# Altium project IO BOARD CERES-V4.PrjPcb
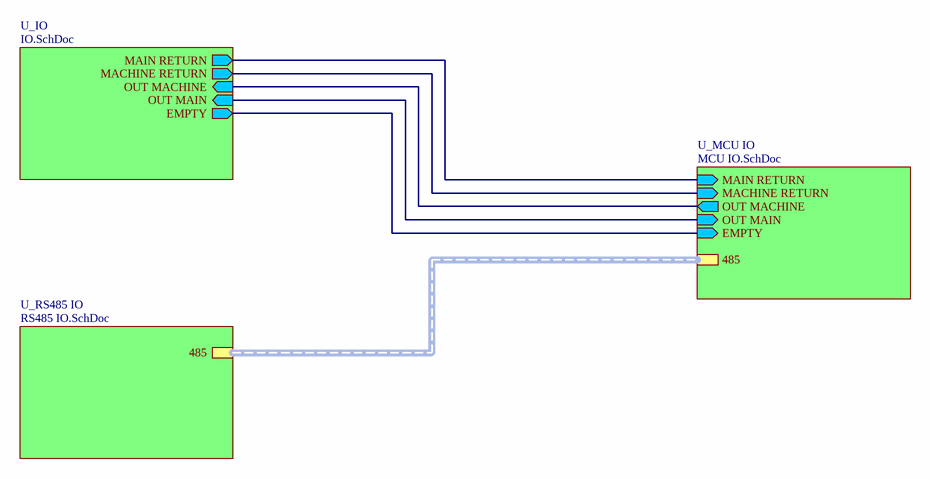
[diagram p0: TOPSHEET.SchDoc]
4 sheets, 62 parts. Net scope: hierarchical (ports join the sheet entries above them; power ports are global).
Board file: IO BOARD CERES V4.PcbDoc
Sheets:
  TOPSHEET.SchDoc
    U_IO = IO.SchDoc
    U_MCU IO = MCU IO.SchDoc
    U_RS485 IO = RS485 IO.SchDoc

## Sheet TOPSHEET.SchDoc: TOPSHEET
size A4; Date: 31 08 2013; Author: Rachid AKKOUCHE; CompanyName: MDI; DrawnBy: Rachid AKKOUCHE; Engineer: Rachid AKKOUCHE; Organization: RASoftware; Address1: 52 J03 rue de la crèche; Address2: 77100 MEAUX; Address3: FRANCE; DocumentNumber: BRA2013090103C1; Revision: C; SheetNumber: 1; SheetTotal: 4; Telephone: +33651604047; Email: rachid.akkouche@wanadoo.fr; Dessinepar: -; Verifiepar: -; Time: 13:22

### Sub-sheets
U_IO = IO.SchDoc: MAIN RETURN (out), OUT MACHINE (in), MACHINE RETURN (out), OUT MAIN (in), EMPTY (out)
U_MCU IO = MCU IO.SchDoc: MAIN RETURN (in), 485 (harness EIA-485), OUT MACHINE (out), MACHINE RETURN (in), EMPTY (in), OUT MAIN (in)
U_RS485 IO = RS485 IO.SchDoc: 485 (harness EIA-485)

### Nets
PGEC1: sheet U_IO/EMPTY, sheet U_MCU IO/EMPTY
PGED1: sheet U_IO/OUT MAIN, sheet U_MCU IO/OUT MAIN
NetC2_1: sheet U_IO/MAIN RETURN, sheet U_MCU IO/MAIN RETURN
NetC3_1: sheet U_IO/MACHINE RETURN, sheet U_MCU IO/MACHINE RETURN
NetQ2_1: sheet U_IO/OUT MACHINE, sheet U_MCU IO/OUT MACHINE

### Buses and harness runs
harness sheet U_MCU IO/485 = sheet U_RS485 IO/485

### Notes on the sheet
- Ce document est la propriété de
- Project:
- Il ne peut être divulgué sans l'accord écrit de l'un de ses représentants dûment mandaté
- Title:
- Number:
- Date:
- Time:
- Size:
- A4
- Revision:
- Sheet
- of
- 52 J03 rue de la crèche
- Draw by:
- 77100 Meaux

## Sheet IO.SchDoc: IO
size A4; Date: 31 08 2013; Author: Rachid AKKOUCHE; CompanyName: MDI; DrawnBy: Rachid AKKOUCHE; Engineer: Rachid AKKOUCHE; Organization: RASoftware; Address1: 52 J03, rue de la crèche; Address2: 77100 MEAUX; Address3: FRANCE; DocumentNumber: BRA2013090103C3; Revision: C; SheetNumber: 3; SheetTotal: 4; Telephone: +33651604047; Email: rachid.akkouche@wanadoo.fr; Dessinepar: -; Verifiepar: -; Property: RASoftware; PageSetup: Record=PageOptions|CenterHorizontal=True|CenterVertical=True|PrintScale=0.88|XCorrection=1.00|YCorrection=1.00|PrintKind=0|BorderSize=5000000|LeftOffset=0|BottomOffset=0|Orientation=2|PaperLength=1000|PaperWidth=1000|Scale=100|PaperSource=7|PrintQuality=-3|MediaType=1|DitherType=10|PrintScaleMode=1|PaperKind=16K|PaperIndex=409; Time: 13:22
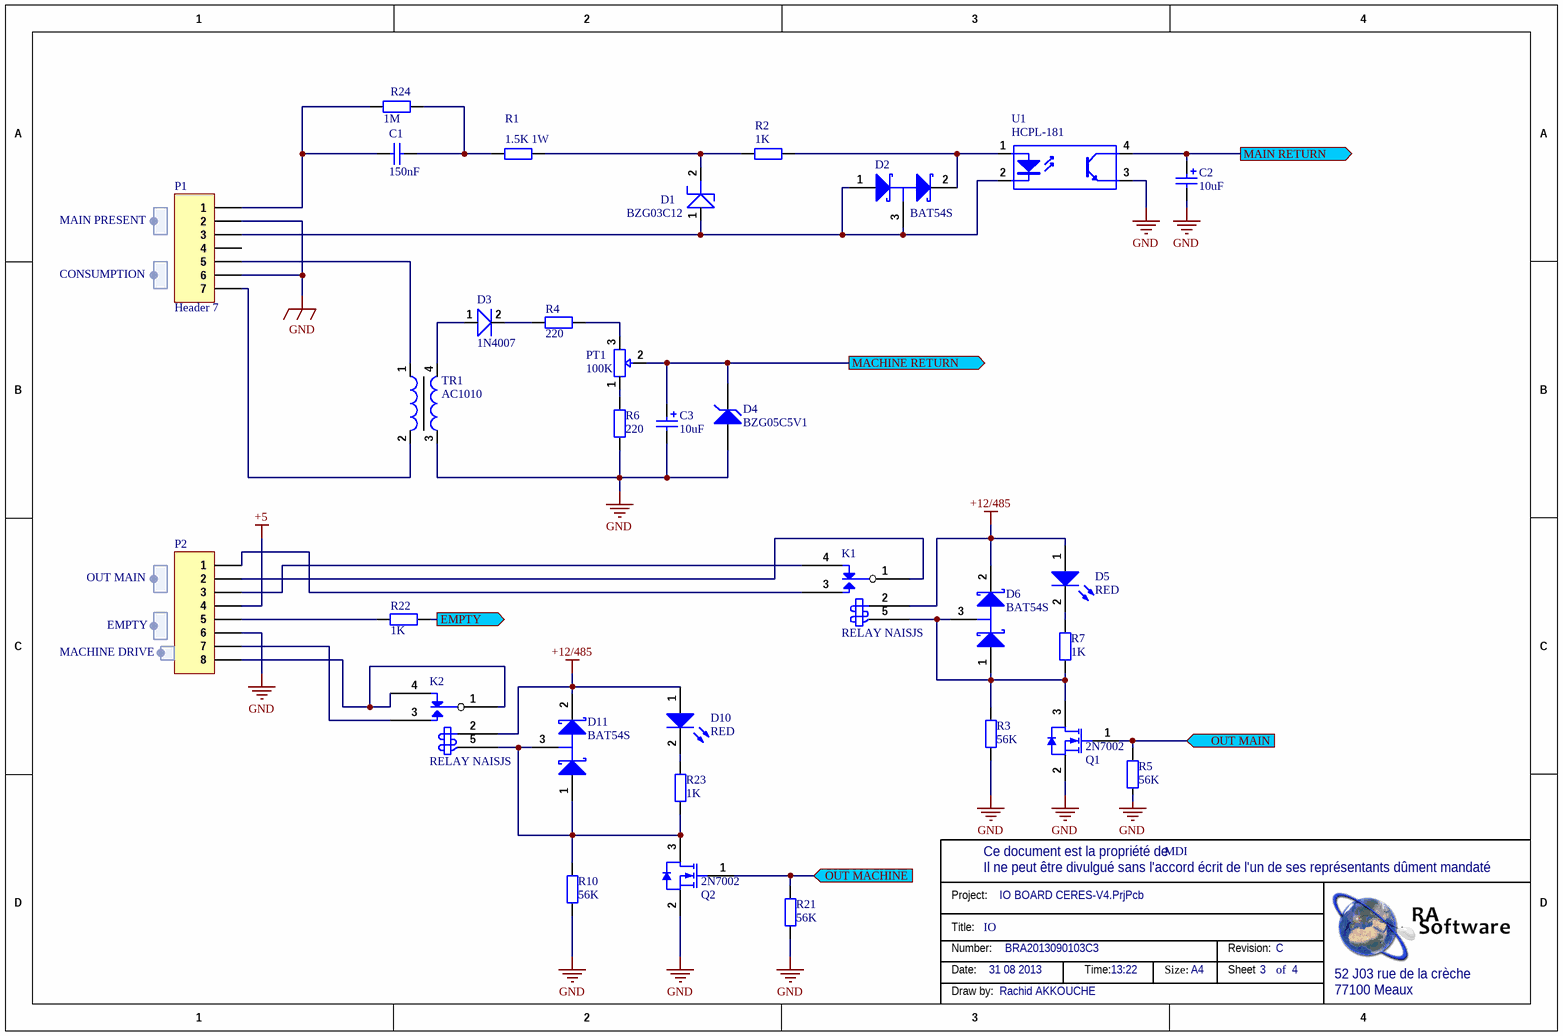
[diagram p1: IO.SchDoc]

### Parts
C1  150nF  [C1210]
C2  10uF  [C0805]
C3  10uF  [C0805]
D1  BZG03C12  [sma]
D2  BAT54S  [SOT23]
D3  1N4007  [SMA]
D4  BZG05C5V1  [SMA]
D5  Couleur: RED  [0603-LEDR]  (hidden comment: HSMH-C190)
D6  BAT54S  [SOT23]
D10  Couleur: RED  [0603-LEDR]  (hidden comment: HSMH-C190)
D11  BAT54S  [SOT23]
K1  RELAY NAISJS  [RELAIG5L]
K2  RELAY NAISJS  [RELAIG5L]
P1  Header 7  [CO7P508-90]
P2  Header 8  [CO8P508 - 90°]  (value not drawn)
PT1  100K  [3361P]
Q1  2N7002  [SOT23]
Q2  2N7002  [SOT23]
R1  1.5K 1W  [R0805]
R2  1K  [R0805]
R3  56K  [R0805]
R4  220  [R0805]
R5  56K  [R0805]
R6  220  [R0805]
R7  1K  [R0805]
R10  56K  [R0805]
R21  56K  [R0805]
R22  1K  [R0805]
R23  1K  [R0805]
R24  1M  [R0805]
TR1  AC1010  [TR-AC10XX]  (no BOM)
U1  HCPL-181  [OPTO-4PIN]

### Ports
EMPTY (out), MACHINE RETURN (out), MAIN RETURN (out), OUT MACHINE (in), OUT MAIN (in)

### Harnesses
?: 

### Nets
+5: P2.4
+12/485: D5.1(A) D6.2(K) D10.1(A) D11.2(K) K1.2(COIL1) K2.2(COIL1)
GND: C2.2 C3.2 D4.1(A) P1.2 P1.6 P2.6 Q1.2(S) Q2.2(S) R3.1 R5.1 R6.1 R10.1 R21.1 TR1.3 U1.3(E)
PGEC1: R22.1 ; port EMPTY
PGED1: Q1.1(G) R5.2 ; port OUT MAIN
NetC1_1: C1.1 P1.1 R24.2
NetC1_2: C1.2 R1.2 R24.1
NetC2_1: C2.1 U1.4(C) ; port MAIN RETURN
NetC3_1: C3.1 D4.2(K) PT1.2 ; port MACHINE RETURN
NetD1_1: D1.1 D2.1(A) D2.3(C) P1.3 U1.2(K)
NetD1_2: D1.2 R1.1 R2.1
NetD2_2: D2.2(K) R2.2 U1.1(A)
NetD3_1: D3.1 TR1.4
NetD3_2: D3.2 R4.2
NetD5_2: D5.2(K) R7.2
NetD6_1: D6.1(A) D6.3(C) K1.5(COIL2) Q1.3(D) R3.2 R7.1
NetD10_2: D10.2(K) R23.2
NetD11_1: D11.1(A) D11.3(C) K2.5(COIL2) Q2.3(D) R10.2 R23.1
NetK1_1: K1.1(COMMON) P2.2
NetK1_3: K1.3(NO) P2.1
NetK1_4: K1.4(NC) P2.3
NetK2_1: K2.1(COMMON) K2.4(NC) P2.8
NetK2_3: K2.3(NO) P2.7
NetP1_5: P1.5 TR1.1
NetP1_7: P1.7 TR1.2
NetP2_5: P2.5 R22.2
NetPT1_1: PT1.1 R6.2
NetPT1_3: PT1.3 R4.1
NetQ2_1: Q2.1(G) R21.2 ; port OUT MACHINE

Not connected (* = marked no-connect by the designer): P1 4

### Notes on the sheet
- MAIN PRESENT
- CONSUMPTION
- OUT MAIN
- MACHINE DRIVE
- EMPTY
- Ce document est la propriété de
- Project:
- Il ne peut être divulgué sans l'accord écrit de l'un de ses représentants dûment mandaté
- Title:
- Number:
- Date:
- Time:
- Size:
- A4
- Revision:
- Sheet
- of
- 52 J03 rue de la crèche
- Draw by:
- 77100 Meaux

### Library data of the parts
C1 = Cap: Capacitor; Manufacturer: KEMET; Manufacturer Part Number: C1210V154KCRACTU; Gamme de produit: KEMET - ArcShield V Series; Capacité: 0.15; Tolérance de capacité: ± 10%; Diélectrique: X7; Tension: 500; Boîtier de condensateur Céramique: 1210 [3225 Metric]; Température d'utilisation min: -55; Température de fonctionnement max..: 125; Type de packaging: Bande découpée; SVHC: No SVHC (16-Dec-2013); Bornes de condensateur: CMS; Température de fonctionnement: -55°C à +125; Type de boîtier de condensateur: 1210 [3225 Metric]<!--FANDB--><div class="features-and-benefits-container"></div>; Supplier 1: Farnell; Supplier Part Number 1: 2085200; RoHS: YES; Pricing 1: 10=0,34, 50=0,28, 100=0,154, 500=0,125, 2500=0,097 (EUR); MSL: MSL 1 - Illimité; Tolérance de capacité ±: ± 10%; ComponentLink1URL: http://www.farnell.com/datasheets/1698777.pdf; ComponentLink1Description: http://www.farnell.com/datasheets/1698777.pdf
C2 C3 = Cap Pol 100uF: Polarized Capacitor; Manufacturer: EPCOS; Manufacturer Part Number: B41142A4107M; Product Range: EPCOS - B41142 Series; Capacité: 100; Tolérance de capacité: ± 20%; Tension: 16; Type de boîtier de condensateur: Radial Can - SMD; Diamètre: 6.3; Résistance, ESR: 0.16; Hauteur: 7.7; Courant d'ondulation c.a.: 300; Type de packaging: Cut Tape; Durée de vie @ température: 2000 heures @ 105; Température d'utilisation min: -55; Température de fonctionnement max..: 105; SVHC: No SVHC (19-Dec-2012); Impédance: 0.26; Température de fonctionnement: -55°C à +105; Température, ESR: 20; Type de boîtier: CMS; Supplier 1: Farnell; RoHS: YES; Pricing 1: 10=0,123, 50=0,095, 100=0,078, 250=0,07, 1000=0,062 (EUR); Courant d'ondulation c.a. à  100Hz: 300; Fréquence, impédance: 100; Longueur/hauteur: 7.7; Température, courant ondulatoire: 105; Température, impédance: 20; ComponentLink1URL: http://www.epcos.com/inf/20/30/db/alu_x/B41142.pdf; ComponentLink1Description: http://www.epcos.com/inf/20/30/db/alu_x/B41142.pdf; Supplier Part Number 1: 1735328
D1 = DZ: Manufacturer: VISHAY; Manufacturer Part Number: BZG03C12TR3; Supplier 1: Farnell; Supplier Part Number 1: 9398090; RoHS: YES; Pricing 1: 5=0,62, 100=0,37, 1500=0,26, 3000=0,138, 7000=0,135, 30000=0,132, 30000=0,129 (EUR); ComponentLink1URL: http://www.farnell.com/datasheets/69906.pdf; ComponentLink1Description: http://www.farnell.com/datasheets/69906.pdf
D2 D6 D11 = BAT54S: Schottky Barrier Double Diode; Manufacturer: MULTICOMP; Courant, If moy.: 200; Tension, Vrrm: 30; Tension, Vf max..: 400; Temps trr max.: 5; Courant, Ifs max.: 600; Type de boîtier diode: SOT-23; Nombre de broches: 3; SVHC: No SVHC (19-Dec-2012); Configuration diode: Dual Series; Température, Tj max..: 150; Type de terminaison: SMD; Température d'utilisation min: -55; Courant, If, Vf: 10; Courant, Ir, max..: 2; Marquage, CMS: L44; Température de fonctionnement: -55°C à +150; Supplier 1: Farnell; Supplier Part Number 1: 1621835; Manufacturer Part Number: BAT54S; RoHS: YES; Stock 1: 52055; Pricing 1: 10=0,102, 250=0,074, 1000=0,06, 3000=0,053 (EUR); Diode Type: Schottky; Type de boîtier: SOT-23; courant Ifsm: 600; ComponentLink1URL: http://www.farnell.com/datasheets/1317753.pdf; ComponentLink1Description: http://www.farnell.com/datasheets/1317753.pdf; Température de fonctionnement max..: 150
D3 = D: Manufacturer: FAIRCHILD SEMICONDUCTOR; Manufacturer Part Number: S1M; Supplier 1: Farnell; Supplier Part Number 1: 9843841; RoHS: YES; Stock 1: 333361; Pricing 1: 10=0,14, 100=0,0666, 200=0,061, 500=0,0574, 1000=0,0293 (EUR); ComponentLink1URL: http://www.farnell.com/datasheets/1766308.pdf; ComponentLink1Description: http://www.farnell.com/datasheets/1766308.pdf
D4 = BZG05C5V1: Silicon Zener Diode (3W); Manufacturer: VISHAY; Manufacturer Part Number: BZG05C5V1TR3; Supplier 1: Farnell; Supplier Part Number 1: 9398015; RoHS: YES; Stock 1: 8912; Pricing 1: 5=0,294, 100=0,122, 1500=0,113, 3000=0,111, 9000=0,107, 30000=0,105, 30000=0,103, 90000=0,101 (EUR); ComponentLink1URL: http://www.farnell.com/datasheets/69919.pdf; ComponentLink1Description: http://www.farnell.com/datasheets/69919.pdf
D5 D10 = HSMH-C190: Surface Mount Chip LED, Red; Manufacturer: AVAGO TECHNOLOGIES; Manufacturer Part Number: HSMH-C190.; Taille de lampe: 0.8mm x 1; Couleur de LED: Rouge; Intensité lumineuse: 17; Angle, vision: 170°; Courant, direct, If: 20; Tension, direct à  If: 1.8; Montage LED: CMS; Forme de lentille: Rectangulaire; Longueur d'onde typ.: 626; SVHC: No SVHC (19-Dec-2012); Dissipation de puissance: 65; Intensité lumineuse min. à  If: 2.8; Intensité lumineuse typique: 10; Largeur (externe): 0.8; Longueur d'onde dominante: 639; Longueur d'onde, crête: 630; Longueur/hauteur: 1.6; Matière: AlGaAs; Nombre de broches: 2; Orientation de montage opto: Dessus; Orientation sortie de lumière: Top Emitting; Température de fonctionnement: -30°C à +85; Température de fonctionnement max..: 85; Température, stockage min.: -40; Température d'utilisation min: -30; Tension, Vf max..: 2.6; Tension, Vf min.: 2.1; Type de LED: Standard; Supplier 1: Farnell; Supplier Part Number 1: 8554641; RoHS: YES; Pricing 1: 5=0,06, 25=0,059, 100=0,057, 250=0,052, 500=0,047 (EUR); MSL: MSL 2A - 4 semaines; Couleur, LED: Rouge; Profondeur: 0.8; Température, stockage max..: 85; Tension, Vf typ.: 1.8; ComponentLink1URL: http://www.farnell.com/datasheets/313031.pdf; ComponentLink1Description: http://www.farnell.com/datasheets/313031.pdf; ComponentLink2URL: http://www.farnell.com/datasheets/55927.pdf; ComponentLink2Description: http://www.farnell.com/datasheets/55927.pdf
K1 K2 = RELAY NAISJS: Manufacturer: OMRON ELECTRONIC COMPONENTS; Manufacturer Part Number: G5LA1A412DC; Type de relais: Puissance; Tension, bobine c.c. nom.: 12; Courant de contact max..: 10; Tension AC nominale du contact: 250; Tension DC nominale du contact: 24; Résistance, bobine: 400; Configuration des contacts: SPST-NO; Type de bobine: CC; Courant de bobine: 30; Puissance de fonctionnement nominale: 360; Montage relais: Traversant; Largeur (externe): 15.8; Profondeur: 19.8; SVHC: No SVHC (20-Jun-2013); Supplier 1: Farnell; Supplier Part Number 1: 2213790; RoHS: YES; Pricing 1: 1=0,84, 10=0,74, 50=0,66, 100=0,59, 250=0,54 (EUR); Hauteur, dimension externe: 15.8; ComponentLink1URL: http://www.farnell.com/datasheets/1648381.pdf; ComponentLink1Description: http://www.farnell.com/datasheets/1648381.pdf
P1 = Header 7: Header, 7-Pin; Manufacturer: FCI; Manufacturer Part Number: 20020110-H071A01LF; Anschlussart: Löten; Anzahl der Kontakte: 7; Anzahl der Reihen: 1; Betriebsspannung: 300 V ac; Breite: 12mm; Farbe: Grün; Gehäuseausrichtung: Rechtwinklig; Gender: Male; Länge: 37.56mm; Montagetyp: Durchsteckmontage; Nennstrom: 12A; Raster: 5.08mm; Serie: 06-508; Tiefe: 8.5mm; Typ: Stiftsockel; Currency: ÿNILÿ; Product StockNumber: 707-5477; Connecteur femelle: 790-0714; LatestRevisionDate: 17-Jul-2002; LatestRevisionNote: Re-released for DXP Platform.; Publisher: Altium Limited; Supplier 1: RS-Components; Supplier Part Number 1: 707-5477; RoHS: Compliant; Category: Steckverbinder; Stock 1: 0; Pricing 1: 5=0,778, 375=0,682, 1250=0,584, 2500=0,486, 5000=0,39 (ÿNILÿ); Material: Nylon; Product Status: ÿNILÿ; Future Stock Date: ÿNILÿ
P2 = Header 8: Header, 8-Pin; Manufacturer: CAMDENBOSS; Manufacturer Part Number: CTB9350/8AO; Gamme de produit: CAMDENBOSS - CTB9350; Type de terminaison de contact: Traversant; Genre: Mâle; Nombre de contacts: 8; Nombre de rangées: 1; Pas: 5; Plaquage du contact: Cuivre; Matériau du contact: Laiton; SVHC: No SVHC (16-Jun-2014); Couleur: vert; Courant: 12; Inflammabilité: UL94V-0; Matériau, vis: Acier; Méthode de terminaison: A souder; Taille du filetage: M3; Température de fonctionnement max..: 125; Température d'utilisation min: -20; Tension nominale Vac: 380; Terminaison du contact: Traversant à angle droit<!--FANDB--><div class="features-and-benefits-container"></div>; Connecteur femelle: 3881891; LatestRevisionDate: 17-Jul-2002; LatestRevisionNote: Re-released for DXP Platform.; Publisher: Altium Limited; Supplier 1: Farnell; Supplier Part Number 1: 3882251; RoHS: YES; Pricing 1: 1=0,963, 25=0,847, 100=0,793, 250=0,732, 700=0,659, 3000=0,581, 3000=0,523, 20000=0,471 (EUR); ComponentLink1URL: http://www.farnell.com/datasheets/1708040.pdf; ComponentLink1Description: http://www.farnell.com/datasheets/1708040.pdf
PT1 = RV: Manufacturer: BOURNS; Manufacturer Part Number: 3361P-1-104GLF; Résistance, piste: 100; Nombre de tours: 1; Tolérance de résistance: ± 10%; Coefficient de température: ± 100; Puissance: 500; Montage du potentiomètre: CMS; SVHC: No SVHC (16-Dec-2013); Force diélectrique, Vca: 900; Largeur (externe): 6.71; Longueur/hauteur: 5.21; Profondeur: 7.04; Série: 3361; Température de fonctionnement: -55°C à +125; Température de fonctionnement max..: 125; Température d'utilisation min: -55; Tension: 300; Type d'ajustement: Fente tournevis; Type de packaging: Bande découpée; Type de résistance: Cermet<!--FANDB--><div class="features-and-benefits-container"></div>; Supplier 1: Farnell; Supplier Part Number 1: 1696064; RoHS: YES; Pricing 1: 5=1,35, 50=1,11, 100=0,99, 250=0,93, 750=0,87 (EUR); ComponentLink1URL: http://www.farnell.com/datasheets/1563530.igs; ComponentLink1Description: http://www.farnell.com/datasheets/1563530.igs; ComponentLink2URL: http://www.farnell.com/datasheets/1815105.pdf; ComponentLink2Description: http://www.farnell.com/datasheets/1815105.pdf; ComponentLink3URL: http://www.farnell.com/cad/1563578.stp; ComponentLink3Description: http://www.farnell.com/cad/1563578.stp
Q1 Q2 = 2N7002: N-channel Enhancement Mode Field-effect Transistor; Manufacturer: FAIRCHILD SEMICONDUCTOR; Supplier 1: Farnell; Supplier Part Number 1: 9845313; Manufacturer Part Number: 2N7002; RoHS: YES; Pricing 1: 5=0,138, 25=0,13, 100=0,059, 1000=0,049, 3000=0,026, 6000=0,0234 (EUR); ComponentLink1URL: http://www.farnell.com/datasheets/660093.pdf; ComponentLink1Description: http://www.farnell.com/datasheets/660093.pdf; ComponentLink2URL: http://www.farnell.com/datasheets/410597.pdf; ComponentLink2Description: http://www.farnell.com/datasheets/410597.pdf
R1 = Resistor 0805 470: Resistor; Manufacturer: MULTICOMP; Manufacturer Part Number: MC0.1W08051%470RFR; Supplier 1: Farnell; Supplier Part Number 1: 2129087; RoHS: YES; Pricing 1: 5000=0,001 (EUR); ComponentLink1URL: http://www.farnell.com/datasheets/1636796.pdf; ComponentLink1Description: http://www.farnell.com/datasheets/1636796.pdf
R2 = Res2: Resistor; Manufacturer: MULTICOMP; Manufacturer Part Number: MC0.1W08051%1KFR; Product Range: MULTICOMP - MC Series; Résistance: 1; Puissance: 100; Tolérance de résistance: ± 1%; Type de boîtier de résistance: 0805; Type de résistance: Couche épaisse; Coefficient de température: ± 100; Tension: 150; Type de packaging: Full Reel; Resistor Mounting: CMS; Supplier 1: Farnell; Supplier Part Number 1: 2129113; RoHS: YES; Stock 1: 599995; Pricing 1: 5000=0,001 (EUR); MSL: MSL 1 - Illimité; ComponentLink1URL: http://www.farnell.com/datasheets/1636796.pdf; ComponentLink1Description: http://www.farnell.com/datasheets/1636796.pdf
R3 R5 R10 R21 = Resistor 0805 56K: Resistor; Manufacturer: MULTICOMP; Manufacturer Part Number: MC0.1W08051%56KFR; Product Range: MULTICOMP - MC Series; Résistance: 56; Puissance: 100; Tolérance de résistance: ± 1%; Type de boîtier de résistance: 0805; Type de résistance: Couche épaisse; Coefficient de température: ± 100; Tension: 150; Type de packaging: Full Reel; Resistor Mounting: CMS; Resistor Terminals: (Non Disponible); Supplier 1: Farnell; RoHS: YES; Pricing 1: 5000=0,001 (EUR); MSL: (Non Applicable); ComponentLink1URL: http://www.farnell.com/datasheets/1716700.pdf; ComponentLink1Description: http://www.farnell.com/datasheets/1716700.pdf; Supplier Part Number 1: 2129258
R4 R6 = Resistor 0805 220: Resistor; Manufacturer: MULTICOMP; Manufacturer Part Number: MC01W08051220R; Gamme de produit: MULTICOMP - MC Series; Puissance: 100; Tolérance de résistance: ± 1%; Type de boîtier de résistance: 0805; Type de résistance: Couche épaisse; Coefficient de température: ± 100; Tension: 150; Type de packaging: Bande et Bobine; SVHC: No SVHC (20-Jun-2013); Montage de résistance: CMS; Quantité par bobine: 5000; Supplier 1: Farnell; RoHS: YES; Stock 1: 199995; Pricing 1: 5000=0,001, 25000=0,0009, 50000=0,0008 (EUR); Résistance: 220; MSL: -; ComponentLink1URL: http://www.farnell.com/datasheets/1729047.pdf; ComponentLink1Description: http://www.farnell.com/datasheets/1729047.pdf; Supplier Part Number 1: 2129060
R7 R22 R23 = Resistor 0805 1K: Resistor; Manufacturer: MULTICOMP; Manufacturer Part Number: MC0.1W08051%1KFR; Product Range: MULTICOMP - MC Series; Résistance: 1; Puissance: 100; Tolérance de résistance: ± 1%; Type de boîtier de résistance: 0805; Type de résistance: Couche épaisse; Coefficient de température: ± 100; Tension: 150; Type de packaging: Full Reel; Resistor Mounting: CMS; Supplier 1: Farnell; RoHS: YES; Pricing 1: 5000=0,001 (EUR); MSL: MSL 1 - Illimité; ComponentLink1URL: http://www.farnell.com/datasheets/1716700.pdf; ComponentLink1Description: http://www.farnell.com/datasheets/1716700.pdf; Supplier Part Number 1: 2129113
R24 = Resistor 0805 470: Resistor; Manufacturer: MULTICOMP; Manufacturer Part Number: MCWR08X1004FTL; Gamme de produit: MULTICOMP - MCWR Series; Résistance: 1; Puissance: 125; Tolérance de résistance: ± 1%; Type de boîtier de résistance: 0805 [2012 Metric]; Type de résistance: Couche épaisse; Coefficient de température: ± 100; Tension: 150; Type de packaging: Bande et Bobine; Supplier 1: Farnell; Supplier Part Number 1: 2446913; RoHS: YES; Stock 1: 119995; Pricing 1: 5000=0,0006 (EUR); MSL: -<!--FANDB--><div class="features-and-benefits-container"></div>; ComponentLink1URL: http://www.farnell.com/datasheets/1849611.pdf; ComponentLink1Description: http://www.farnell.com/datasheets/1849611.pdf
TR1 = AC1010: Manufacturer: ACME ELECTRIC; Manufacturer Part Number: AC-1010; Input Current: 10; Turns Ratio: 1; Frequency Min: 50; Frequency Max: 60; Secondary Burden Resistance: 41.8; Transformer Mounting: Through Hole; External Depth: 11.12; Supplier 1: Farnell; Supplier Part Number 1: 1707836; RoHS: YES; Pricing 1: 1=12,43, 10=10,33, 25=8,31, 50=7,37, 100=6,71 (EUR); DC Resistance Max: 41.8; ComponentLink1URL: http://www.amveco.com/pdf/AC1010.pdf; ComponentLink1Description: http://www.amveco.com/pdf/AC1010.pdf
U1 = Optoisolator1: 4-Pin Phototransistor Optocoupler; Manufacturer: AVAGO TECHNOLOGIES; Manufacturer Part Number: HCPL-181-00AE; Supplier 1: Farnell; Supplier Part Number 1: 1244526RL; RoHS: YES; Pricing 1: 150=0,27, 250=0,217, 500=0,191, 2000=0,143, 2000=0,14, 20000=0,137 (EUR); ComponentLink1URL: http://www.farnell.com/datasheets/317140.pdf; ComponentLink1Description: http://www.farnell.com/datasheets/317140.pdf

## Sheet MCU IO.SchDoc: MCU
size A4; Date: 30 08 2013; Author: Rachid AKKOUCHE; CompanyName: MDI; DrawnBy: Rachid AKKOUCHE; Engineer: Rachid AKKOUCHE; Organization: RASoftware; Address1: 52 J03, rue de la crèche; Address3: 77100 MEAUX; Address4: FRANCE; DocumentNumber: BRA2013090103C2; Revision: C; SheetNumber: 2; SheetTotal: 4; Telephone: +33651604047; Email: rachid.akkouche@wanadoo.fr; Dessinepar: -; Verifiepar: -; Property: RASoftware; Time: 13:00; ProjectName: IO BOARD CERES-V3; Application_BuildNumber: 01
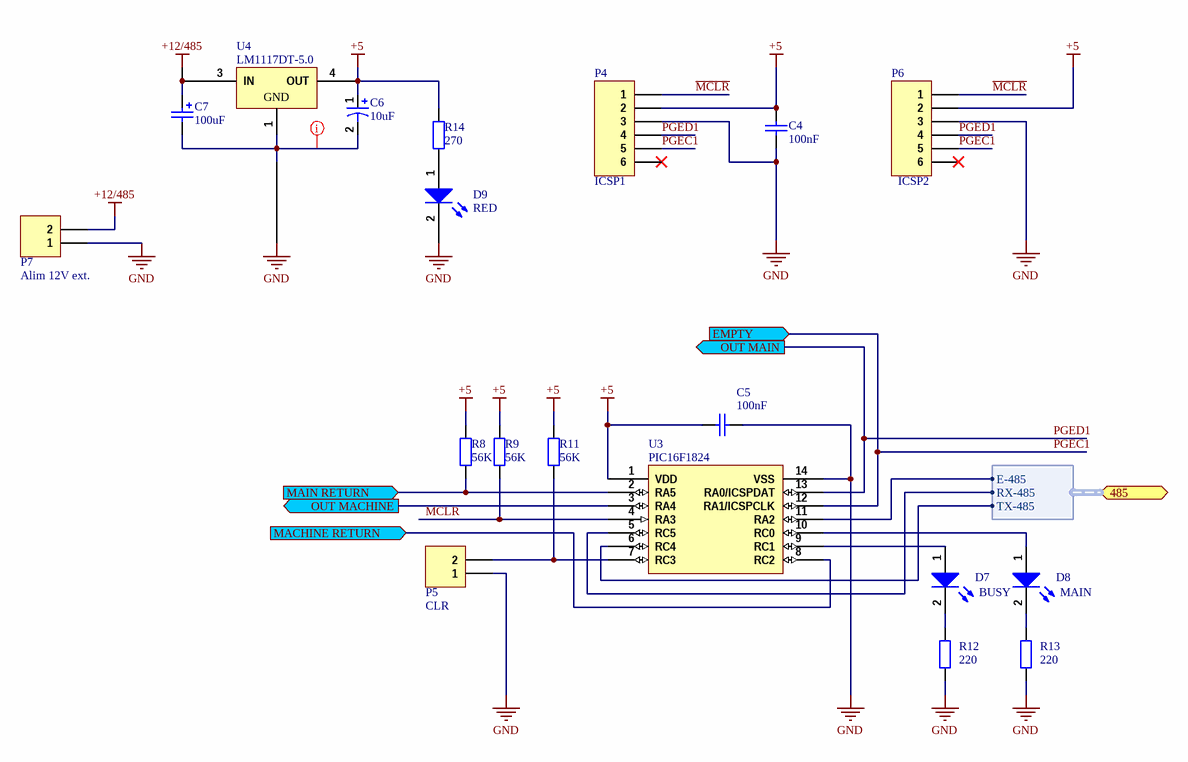
[diagram p2: MCU IO.SchDoc]

### Parts
C4  100nF  [C0805]
C5  100nF  [C0805]
C6  10uF  [KEMET_4]
C7  100uF  [Kemet_63]
D7  Indicator: BUSY  [0603-LEDR]  (hidden comment: HSMH-C190)
D8  Indicator: MAIN  [0603-LEDV]  (hidden comment: HSMH-C190)
D9  Couleur: RED  [0603-LEDR]  (hidden comment: HSMH-C190)
P4  ICSP1  [TC2030]  (no BOM)
P5  CLR  [M20_1X2]
P6  ICSP2  [6SIP100]  (no BOM)
P7  Alim 12V ext.  [CO2P508]  (no BOM)
R8  56K  [R0805]
R9  56K  [R0805]
R11  56K  [R0805]
R12  220  [R0805]
R13  220  [R0805]
R14  270  [R0805]
U3  PIC16F1824  [so-14]
U4  LM1117DT-5.0  [SOT223]

### Ports
485 (harness EIA-485), EMPTY (in), MACHINE RETURN (in), MAIN RETURN (in), OUT MACHINE (out), OUT MAIN (out)

### Harnesses
EIA-485: TX-485, RX-485, E-485

### Nets
+5: C4.2 C5.2 C6.1 P4.2 P6.2 R8.2 R9.2 R11.2 R14.2 U3.1(VDD) U4.4(OUT)
+12/485: C7.1 P7.2 U4.3(IN)
GND: C4.1 C5.1 C6.2 C7.2 D9.2(K) P4.3 P5.1 P6.3 P7.1 R12.1 R13.1 U3.14(VSS) U4.1(GND)
~{MCLR}: P4.1 P6.1 R9.1 U3.4(RA3)
PGEC1: P4.5 P6.5 U3.12(RA1/ICSPCLK) ; port EMPTY
PGED1: P4.4 P6.4 U3.13(RA0/ICSPDAT) ; port OUT MAIN
NetC2_1: R8.1 U3.2(RA5) ; port MAIN RETURN
NetC3_1: U3.8(RC2) ; port MACHINE RETURN
NetD7_1: D7.1(A) U3.9(RC1)
NetD7_2: D7.2(K) R12.2
NetD8_1: D8.1(A) U3.10(RC0)
NetD8_2: D8.2(K) R13.2
NetD9_1: D9.1(A) R14.1
NetP5_2: P5.2 R11.1 U3.7(RC3)
NetQ2_1: U3.3(RA4) ; port OUT MACHINE
NetR18_2: U3.11(RA2) ; port 485.E-485
NetU3_5: U3.5(RC5) ; port 485.RX-485
NetU3_6: U3.6(RC4) ; port 485.TX-485

Not connected (* = marked no-connect by the designer): P4 6*; P6 6*

### Layout directives
rule Width Constraint [Pref Width = 0.55mm    Min Width = 0.254mm    Max Width = 2mm]: GND

### Notes on the sheet
- Ce document est la propriété de
- Project:
- Il ne peut être divulgué sans l'accord écrit de l'un de ses représentants dûment mandaté
- Title:
- Number:
- Date:
- Time:
- Size:
- A4
- Revision:
- Sheet
- of
- 52 J03 rue de la crèche
- Draw by:
- 77100 Meaux

### Library data of the parts
C4 C5 = Cap 0805 100nF: Capacitor; Manufacturer: MULTICOMP; Manufacturer Part Number: MCCA000296; Supplier 1: Farnell; Supplier Part Number 1: 1759167; Pricing 1: 100=0,01, 500=0,008, 1000=0,006, 4000=0,005 (EUR); ComponentLink1URL: http://www.farnell.com/datasheets/1520827.pdf; ComponentLink1Description: http://www.farnell.com/datasheets/1520827.pdf
C6 = Cap Pol1: Polarized Capacitor; Manufacturer: KEMET; Manufacturer Part Number: EXV106M025A9BAA; Supplier 1: Farnell; Supplier Part Number 1: 2069174; RoHS: YES; Pricing 1: 10=0,111, 100=0,085, 500=0,074, 1000=0,07, 5000=0,066 (EUR); ComponentLink1URL: http://www.farnell.com/datasheets/1500293.pdf; ComponentLink1Description: http://www.farnell.com/datasheets/1500293.pdf
C7 = Cap Pol 100uF: as C2 on sheet IO; Supplier 1: Farnell; RoHS: YES; Pricing 1: 10=0,123, 50=0,095, 100=0,078, 250=0,07, 1000=0,062 (EUR); Courant d'ondulation c.a. à  100Hz: 300; Fréquence, impédance: 100; Longueur/hauteur: 7.7; Température, courant ondulatoire: 105; Température, impédance: 20; ComponentLink1URL: http://www.epcos.com/inf/20/30/db/alu_x/B41142.pdf; ComponentLink1Description: http://www.epcos.com/inf/20/30/db/alu_x/B41142.pdf; Supplier Part Number 1: 1735328
D7-D9 = HSMH-C190: as D5 on sheet IO; Supplier 1: Farnell; Supplier Part Number 1: 8554641; RoHS: YES; Pricing 1: 5=0,06, 25=0,059, 100=0,057, 250=0,052, 500=0,047 (EUR); MSL: MSL 2A - 4 semaines; Couleur, LED: Rouge; Profondeur: 0.8; Température, stockage max..: 85; Tension, Vf typ.: 1.8; ComponentLink1URL: http://www.farnell.com/datasheets/313031.pdf; ComponentLink1Description: http://www.farnell.com/datasheets/313031.pdf; ComponentLink2URL: http://www.farnell.com/datasheets/55927.pdf; ComponentLink2Description: http://www.farnell.com/datasheets/55927.pdf
  D7 D8: Couleur: RED
  D9: Stock 1: 13902
P4 = Header 6: Header, 6-Pin; Manufacturer: HARWIN; Manufacturer Part Number: M20-8770642; Type de connecteur: Contact fil-à-carte; Série: M20; Terminaison du contact: Montage en surface vertical; Genre: Embase; Nombre de contacts: 6; Nombre de rangées: 1; Pas: 2.54; Plaquage du contact: Or; Matériau du contact: Laiton; SVHC: No SVHC (19-Dec-2012); Supplier 1: Farnell; Supplier Part Number 1: 1517384; RoHS: YES; Stock 1: 3471; Pricing 1: 10=0,69, 20=0,66, 50=0,62, 100=0,6, 250=0,56, 500=0,49 (EUR); Pas, rang: 2.54; ComponentLink1URL: http://www.farnell.com/datasheets/1089524.pdf; ComponentLink1Description: http://www.farnell.com/datasheets/1089524.pdf; ComponentLink2URL: http://www.farnell.com/datasheets/5481.pdf; ComponentLink2Description: http://www.farnell.com/datasheets/5481.pdf
P5 = Header 2: Header, 2-Pin; Manufacturer: HARWIN; Manufacturer Part Number: M20-8770242; LatestRevisionDate: 17-Jul-2002; LatestRevisionNote: Re-released for DXP Platform.; Publisher: Altium Limited; Supplier 1: Farnell; Supplier Part Number 1: 1895211; RoHS: YES; Pricing 1: 10=0,137, 20=0,136, 50=0,135, 100=0,133, 250=0,128, 500=0,12 (EUR); ComponentLink1URL: http://www.farnell.com/cad/1330190.pdf; ComponentLink1Description: http://www.farnell.com/cad/1330190.pdf
P6 = Header 6: Header, 6-Pin; Manufacturer: TE CONNECTIVITY / AMP; Manufacturer Part Number: 4-103321-8.; Série: AMPMODU; Pas: 2.54; Nombre de rangées: 1; Nombre de contacts: 40; Genre: Embase; Terminaison du contact: A souder; Plaquage du contact: Etain; Matériau du contact: Bronze phosphoreux; Courant: 3; Matériau isolant: Thermoplastique; Organismes d'agrément: CSA, UL; Résistance d'isolement: 500; Température de fonctionnement max..: 105; Température d'utilisation min: -65; Type de boitier: Plastique noir UL94V-0; Supplier 1: Farnell; Supplier Part Number 1: 1098454; RoHS: YES; Stock 1: 2602; Pricing 1: 1=2,12, 50=1,79, 100=1,34, 500=1,14, 1000=1,05 (EUR); Méthode de terminaison: A souder; ComponentLink1URL: http://www.tycoelectronics.com/commerce/DocumentDelivery/DDEController?Action=srchrtrv&DocNm=4-103321-8&DocType=Customer+View+Model&DocLang=English; ComponentLink1Description: http://www.tycoelectronics.com/commerce/DocumentDelivery/DDEController?Action=srchrtrv&DocNm=4-103321-8&DocType=Customer+View+Model&DocLang=English; ComponentLink2URL: http://www.farnell.com/datasheets/38278.pdf; ComponentLink2Description: http://www.farnell.com/datasheets/38278.pdf
P7 = Header 2: Header, 2-Pin
R8 R9 R11 = Resistor 0805 56K: as R3 on sheet IO; Supplier 1: Farnell; RoHS: YES; Pricing 1: 5000=0,001 (EUR); MSL: (Non Applicable); ComponentLink1URL: http://www.farnell.com/datasheets/1716700.pdf; ComponentLink1Description: http://www.farnell.com/datasheets/1716700.pdf; Supplier Part Number 1: 2129258
R12 R13 = Resistor 0805 220: as R4 on sheet IO; Supplier 1: Farnell; RoHS: YES; Stock 1: 199995; Pricing 1: 5000=0,001, 25000=0,0009, 50000=0,0008 (EUR); Résistance: 220; MSL: -; ComponentLink1URL: http://www.farnell.com/datasheets/1729047.pdf; ComponentLink1Description: http://www.farnell.com/datasheets/1729047.pdf; Supplier Part Number 1: 2129060
R14 = Resistor 0805 1K: as R7 on sheet IO; Supplier 1: Farnell; RoHS: YES; Pricing 1: 5000=0,001 (EUR); MSL: MSL 1 - Illimité; ComponentLink1URL: http://www.farnell.com/datasheets/1716700.pdf; ComponentLink1Description: http://www.farnell.com/datasheets/1716700.pdf; Supplier Part Number 1: 2129113
U3 = PIC16(L)F1824: 14 Pin Flash Microcontrollers with XLP Technology; Manufacturer: MICROCHIP; Manufacturer Part Number: PIC16F1824-I/SL; Supplier 1: Farnell; RoHS: YES; Stock 1: 516; ComponentLink1URL: http://www.farnell.com/datasheets/1669488.pdf; ComponentLink1Description: http://www.farnell.com/datasheets/1669488.pdf; ComponentLink2URL: http://www.farnell.com/cad/1689044.zip; ComponentLink2Description: http://www.farnell.com/cad/1689044.zip; Supplier Part Number 1: 1814945
U4 = LM1117DT-5.0: 800mA Low-Dropout Linear Regulator, 3-pin TO-252; Manufacturer: TEXAS INSTRUMENTS; Manufacturer Part Number: LM1117MP-5.0; Supplier 1: Farnell; Supplier Part Number 1: 9778209; RoHS: YES; Pricing 1: 1=0,9, 10=0,86, 100=0,73 (EUR); ComponentLink1URL: http://www.farnell.com/datasheets/1685500.pdf; ComponentLink1Description: http://www.farnell.com/datasheets/1685500.pdf; ComponentLink2URL: http://www.farnell.com/cad/1562101.zip; ComponentLink2Description: http://www.farnell.com/cad/1562101.zip

## Sheet RS485 IO.SchDoc: RS-485
size A4; Date: 31 08 2013; Author: Rachid AKKOUCHE; CompanyName: MDI; DrawnBy: Rachid AKKOUCHE; Engineer: Rachid AKKOUCHE; Organization: RASoftware; Address1: 52 J03, rue de la crèche; Address2: 77100 MEAUX; Address3: FRANCE; DocumentNumber: BRA2013090103C4; Revision: C; SheetNumber: 4; SheetTotal: 4; Telephone: +33651604047; Email: rachid.akkouche@wanadoo.fr; Dessinepar: -; Verifiepar: -; Property: RASoftware; Time: 13:22
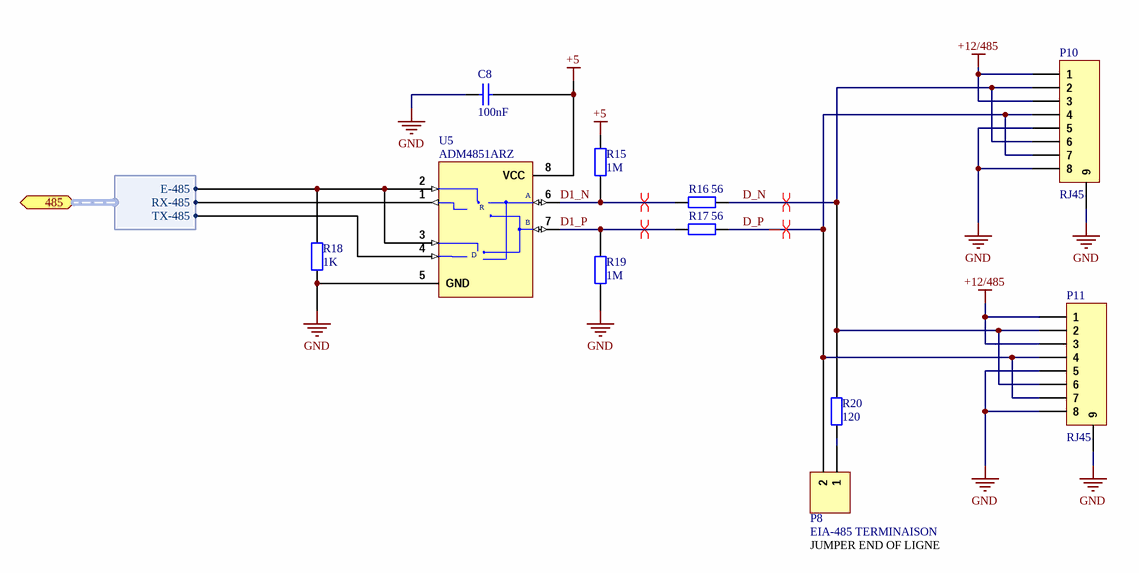
[diagram p3: RS485 IO.SchDoc]

### Parts
C8  100nF  [C0805]
P8  EIA-485 TERMINAISON  [M20_1X2]
P10  RJ45  [AMPHENOL-RJ45_8]
P11  RJ45  [AMPHENOL-RJ45_8]
R15  1M  [R0805]
R16  56  [R0805]
R17  56  [R0805]
R18  1K  [R0805]
R19  1M  [R0805]
R20  120  [R0805]
U5  ADM4851ARZ  [SOIC8]

### Ports
485 (harness EIA-485)

### Harnesses
EIA-485: TX-485, RX-485, E-485

### Nets
+5: C8.1 R15.2 U5.8(VCC)
+12/485: P10.1 P10.3 P11.1 P11.3
GND: C8.2 P10.5 P10.8 P10.9 P11.5 P11.8 P11.9 R18.1 R19.1 U5.5(GND)
D1_N: R15.1 R16.1 U5.6(A)
D1_P: R17.1 R19.2 U5.7(B)
D_N: P10.2 P10.6 P11.2 P11.6 R16.2 R20.2
D_P: P8.2 P10.4 P10.7 P11.4 P11.7 R17.2
NetP8_1: P8.1 R20.1
NetR18_2: R18.2 U5.2(~{RE}) U5.3(DE) ; port 485.E-485
NetU3_5: U5.1(RO) ; port 485.RX-485
NetU3_6: U5.4(DI) ; port 485.TX-485

### Layout directives
differential pair: D1_N, D1_P, D_N, D_P

### Notes on the sheet
- JUMPER END OF LIGNE
- Ce document est la propriété de
- Project:
- Il ne peut être divulgué sans l'accord écrit de l'un de ses représentants dûment mandaté
- Title:
- Number:
- Date:
- Time:
- Size:
- A4
- Revision:
- Sheet
- of
- 52 J03 rue de la crèche
- Draw by:
- 77100 Meaux
- (in symbol MAX485ESA) R; D

### Library data of the parts
C8 = Cap 0805 100nF: as C4 on sheet MCU IO; Supplier 1: Farnell; Supplier Part Number 1: 1759167; Pricing 1: 100=0,01, 500=0,008, 1000=0,006, 4000=0,005 (EUR); ComponentLink1URL: http://www.farnell.com/datasheets/1520827.pdf; ComponentLink1Description: http://www.farnell.com/datasheets/1520827.pdf
P8 = Header 2: Header, 2-Pin; Manufacturer: HARWIN; Manufacturer Part Number: M20-8770242; Product Range: HARWIN - M20-87 Series; Terminaison du contact: PCB; Genre: Connecteur mâle; Nombre de contacts: 2; Nombre de rangées: 1; Pas: 2.54; Plaquage du contact: Or; Matériau du contact: Laiton; SVHC: No SVHC (20-Jun-2013); LatestRevisionDate: 17-Jul-2002; LatestRevisionNote: Re-released for DXP Platform.; Publisher: Altium Limited; Supplier 1: Farnell; Supplier Part Number 1: 1895211; RoHS: YES; Pricing 1: 10=0,137, 20=0,136, 50=0,135, 100=0,133, 250=0,128, 500=0,12 (EUR); ComponentLink1URL: http://www.farnell.com/cad/1330190.pdf; ComponentLink1Description: http://www.farnell.com/cad/1330190.pdf
P10 P11 = Header 8: Header, 8-Pin; Manufacturer: MOLEX; Manufacturer Part Number: 85513-5013; Genre: Embase; Nombre de contacts: 8; Nombre de ports: 1; Catégorie LAN: Cat3; Terminaison du contact: Montage en surface vertical; Plaquage du contact: Or; Matériau du contact: Bronze phosphoreux; Approval Category: UL 94V-0; Couleur: Black; Courant: 1.5; Force diélectrique, Vca: 1000; Inflammabilité: UL94V-0; Largeur (externe): 15.9; Longueur/hauteur: 13; Matière: Glass Filled LCP; Profondeur: 18.8; Résistance d'isolement: 500; Résistance, contact: 20; Température de fonctionnement max..: 80; Température d'utilisation min: -40; Tension c.a.: 125; Supplier 1: Farnell; Supplier Part Number 1: 1345055; RoHS: YES; Pricing 1: 1=0,98, 10=0,92, 50=0,86, 100=0,74 (EUR); Type de connecteur: RJ45; Nombre de positions: 8; Body Plating: Or; Nombre de voies: 8; ComponentLink1URL: http://www.farnell.com/cad/1734187.pdf; ComponentLink1Description: http://www.farnell.com/cad/1734187.pdf; ComponentLink2URL: http://www.farnell.com/datasheets/1733622.pdf; ComponentLink2Description: http://www.farnell.com/datasheets/1733622.pdf
R15 R19 = Resistor 0805 1M: Resistor
R16 R17 = Resistor 0805 56: Resistor; Manufacturer: MULTICOMP; Manufacturer Part Number: MC01W0805156R; Product Range: MULTICOMP - MC Series; Puissance: 100; Tolérance de résistance: ± 1%; Type de boîtier de résistance: 0805; Type de résistance: Couche épaisse; Coefficient de température: ± 200; Tension: 150; Type de packaging: Full Reel; SVHC: No SVHC (20-Jun-2013); Resistor Mounting: CMS; Supplier 1: Farnell; RoHS: YES; Pricing 1: 5000=0,001 (EUR); Résistance: 56; MSL: (Non Applicable); ComponentLink1URL: http://www.farnell.com/datasheets/1729047.pdf; ComponentLink1Description: http://www.farnell.com/datasheets/1729047.pdf; Supplier Part Number 1: 2129016
R18 = Resistor 0805 1K: as R7 on sheet IO; Supplier 1: Farnell; RoHS: YES; Pricing 1: 5000=0,001 (EUR); MSL: MSL 1 - Illimité; ComponentLink1URL: http://www.farnell.com/datasheets/1716700.pdf; ComponentLink1Description: http://www.farnell.com/datasheets/1716700.pdf; Supplier Part Number 1: 2129113
R20 = Resistor 0805 120: Resistor; Manufacturer: MULTICOMP; Manufacturer Part Number: MC01W080516K49; Product Range: MULTICOMP - MC Series; Résistance: 6.49; Puissance: 100; Tolérance de résistance: ± 1%; Type de boîtier de résistance: 0805; Type de résistance: Couche épaisse; Coefficient de température: ± 100; Tension: 150; Type de packaging: Full Reel; SVHC: No SVHC (20-Jun-2013); Resistor Mounting: CMS; Supplier 1: Farnell; RoHS: YES; Pricing 1: 5000=0,001 (EUR); MSL: (Non Applicable); ComponentLink1URL: http://www.farnell.com/datasheets/1729047.pdf; ComponentLink1Description: http://www.farnell.com/datasheets/1729047.pdf; Supplier Part Number 1: 2129181
U5 = MAX485ESA: Low-Power, Slew-Rate-Limited RS-485/RS-422 Transceiver; Manufacturer: ANALOG DEVICES; Type de driver: Émetteur-récepteur de ligne différentiel; Type d'interface CI: RS422, RS485; Nombre de drivers: 1; Tension, alimentation min.: 4.75; Tension, alimentation max..: 5.25; Type de boîtier CI Driver: NSOIC; Nombre de broches: 8; Température d'utilisation min: -40; Température de fonctionnement max..: 85; SVHC: No SVHC (20-Jun-2013); Supplier 1: Farnell; Supplier Part Number 1: 2313594; Manufacturer Part Number: ADM4851ARZ; RoHS: YES; Pricing 1: 1=1,39, 10=1,13, 100=1,01, 250=0,9, 500=0,79 (EUR); MSL: MSL 1 - Illimité; ComponentLink1URL: http://www.analog.com/static/imported-files/data_sheets/ADM4850_4851_4852_4853_4854_4855_4856_4857.pdf; ComponentLink1Description: http://www.analog.com/static/imported-files/data_sheets/ADM4850_4851_4852_4853_4854_4855_4856_4857.pdf; ComponentLink2URL: http://www.farnell.com/cad/1713403.zip; ComponentLink2Description: http://www.farnell.com/cad/1713403.zip

## Nets that join several sheets
+5: IO (P2.4), MCU IO (11 pins), RS485 IO (C8.1 R15.2 U5.8)
+12/485: IO (6 pins), MCU IO (C7.1 P7.2 U4.3), RS485 IO (P10.1 P10.3 P11.1 P11.3)
GND: IO (15 pins), MCU IO (13 pins), RS485 IO (10 pins)
NetC2_1: IO (C2.1 U1.4), MCU IO (R8.1 U3.2)
NetC3_1: IO (C3.1 D4.2 PT1.2), MCU IO (U3.8)
NetQ2_1: IO (Q2.1 R21.2), MCU IO (U3.3)
NetR18_2: MCU IO (U3.11), RS485 IO (R18.2 U5.2 U5.3)
NetU3_5: MCU IO (U3.5), RS485 IO (U5.1)
NetU3_6: MCU IO (U3.6), RS485 IO (U5.4)
PGEC1: IO (R22.1), MCU IO (P4.5 P6.5 U3.12)
PGED1: IO (Q1.1 R5.2), MCU IO (P4.4 P6.4 U3.13)